# Altium schematic sheet HMI.SchDoc
size A4
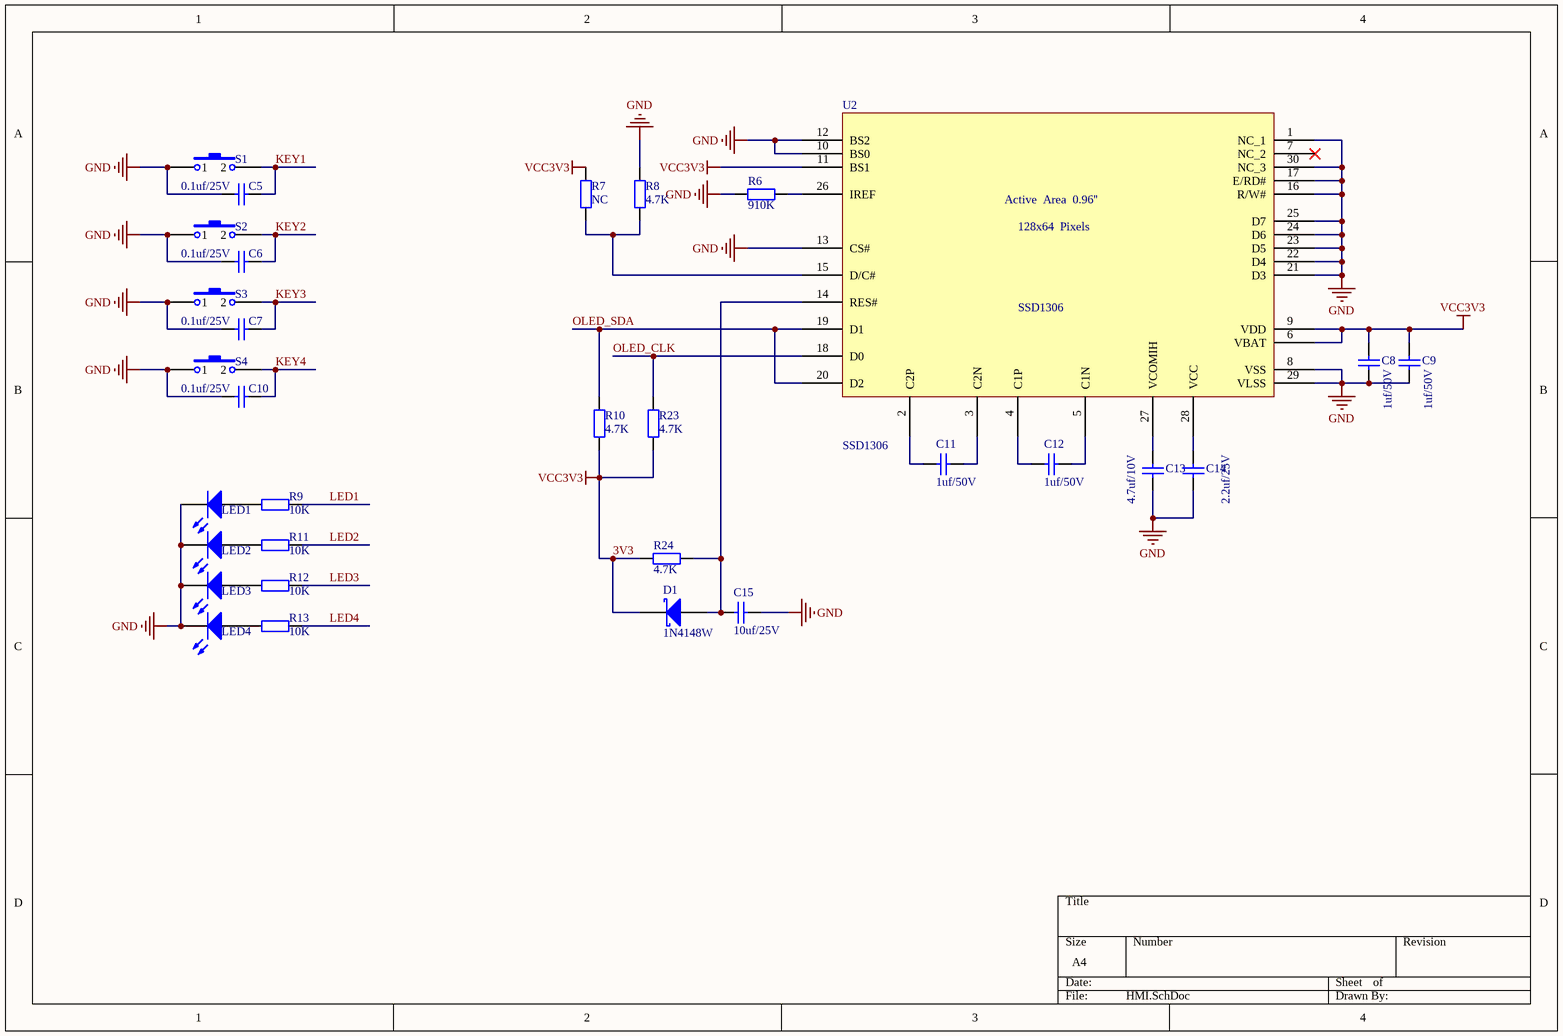
[diagram p0: HMI.SchDoc]

## Parts
C5  0.1uf/25V  [C_0603]
C6  0.1uf/25V  [C_0603]
C7  0.1uf/25V  [C_0603]
C8  1uf/50V  [C_0603]
C9  1uf/50V  [C_0603]
C10  0.1uf/25V  [C_0603]
C11  1uf/50V  [C_0603]
C12  1uf/50V  [C_0603]
C13  4.7uf/10V  [C_0603]
C14  2.2uf/25V  [C_0603]
C15  10uf/25V  [C_0603]
D1  1N4148W  [SOD123]
LED1  19-21SYGC/S530-E2/TR8  [LED_0603]  (value not drawn)
LED2  19-21SYGC/S530-E2/TR8  [LED_0603]  (value not drawn)
LED3  19-21SYGC/S530-E2/TR8  [LED_0603]  (value not drawn)
LED4  19-21SYGC/S530-E2/TR8  [LED_0603]  (value not drawn)
R6  910K  [R_0603]
R7  NC  [R_0603]
R8  4.7K  [R_0603]
R9  10K  [R_0603]
R10  4.7K  [R_0603]
R11  10K  [R_0603]
R12  10K  [R_0603]
R13  10K  [R_0603]
R23  4.7K  [R_0603]
R24  4.7K  [R_0603]
S1  K2-1107ST-A4SW-06  [SW-2P-6*3-SMT]  (value not drawn)
S2  K2-1107ST-A4SW-06  [SW-2P-6*3-SMT]  (value not drawn)
S3  K2-1107ST-A4SW-06  [SW-2P-6*3-SMT]  (value not drawn)
S4  K2-1107ST-A4SW-06  [SW-2P-6*3-SMT]  (value not drawn)
U2  SSD1306  [显示屏1.3"]

## Nets
3V3: C8.2 C9.2 D1.2(K) R7.2 R10.1 R23.1 R24.2 U2.6(VBAT) U2.9(VDD) U2.11(BS1)  [also labelled VCC3V3]
GND: C5.1 C6.1 C7.1 C8.1 C9.1 C10.1 C13.1 C14.1 C15.2 LED1.2(Cathode) LED2.2(Cathode) LED3.2(Cathode) LED4.2(Cathode) R6.1 R8.2 S1.1 S2.1 S3.1 S4.1 U2.1(NC_1) U2.8(VSS) U2.10(BS0) U2.12(BS2) U2.13(CS#) U2.16(R/W#) U2.17(E/RD#) U2.21(D3) U2.22(D4) U2.23(D5) U2.24(D6) U2.25(D7) U2.29(VLSS) U2.30(NC_3)
KEY1: C5.2 S1.2
KEY2: C6.2 S2.2
KEY3: C7.2 S3.2
KEY4: C10.2 S4.2
LED1: R9.2
LED2: R11.2
LED3: R12.2
LED4: R13.2
OLED_CLK: R23.2 U2.18(D0)
OLED_SDA: R10.2 U2.19(D1) U2.20(D2)
NetC11_1: C11.1 U2.2(C2P)
NetC11_2: C11.2 U2.3(C2N)
NetC12_1: C12.1 U2.4(C1P)
NetC12_2: C12.2 U2.5(C1N)
NetC13_2: C13.2 U2.27(VCOMIH)
NetC14_2: C14.2 U2.28(VCC)
NetC15_1: C15.1 D1.1(A) R24.1 U2.14(RES#)
NetLED1_1: LED1.1(Anode) R9.1
NetLED2_1: LED2.1(Anode) R11.1
NetLED3_1: LED3.1(Anode) R12.1
NetLED4_1: LED4.1(Anode) R13.1
NetR6_2: R6.2 U2.26(IREF)
NetR7_1: R7.1 R8.1 U2.15(D/C#)

Not connected (* = marked no-connect by the designer): U2 7(NC_2)*

## Notes on the sheet
- (in symbol SSD1306) Active  Area  0.96''; 128x64  Pixels

## Library data of the parts
C5-C7 C10 = C-0603-0.1uf/25V-10%: 多层片式陶瓷电容器; 精度: 5%; 物料厂家: YAGEO; 原厂订货号: CC0603JRX7R8BB104; 封装: C_0603; 描述: 多层片式陶瓷电容器; 值: 0.1uf/25V
C8 C9 C11 C12 = C-0603-1uf/50V-10%: 多层片式陶瓷电容器; 精度: 10%; 物料厂家: 三星; 原厂订货号: CL10A105KB8NNNC; 天远物料编号: 141111000270; 封装: C_0603; 描述: 多层片式陶瓷电容器; 值: 1uf/50V
C13 = C-0603-4.7uf/10V-10%: 多层片式陶瓷电容器; 精度: 10%; 物料厂家: SAMSUNG; 原厂订货号: CL10A475KP8NNNC; 天远物料编号: 141111000311; 封装: C_0603; 描述: 多层片式陶瓷电容器; 值: 4.7uf/10V
C14 = C-0603-2.2uf/25V-10%: 多层片式陶瓷电容器; 精度: 10%; 物料厂家: Yageo; 原厂订货号: CC0603KRX5R8BB225; 天远物料编号: 141111000026; 封装: C_0603; 描述: 多层片式陶瓷电容器; 值: 2.2uf/25V
C15 = C-0603-10uf/25V-20%: 多层片式陶瓷电容器; 精度: 20%; 物料厂家: Samsung; 原厂订货号: CL10A106MA8NRNC; 天远物料编号: 141111000275; 封装: C_0603; 描述: 多层片式陶瓷电容器; 值: 10uf/25V
D1 = D_Schottky_1N4148W: 肖特基二极管SOD123; 物料厂家: MDD; 描述: 肖特基二极管   100V,150mA,trr=4ns,VF=1.25V@150mA,PD=200mW; 天远物料编号: 141112000002; 精度: *; 封装: SOD123; 原厂订货号: 1N4148W; 值: 1N4148W
LED1-LED4 = LED1_19-21SYGC/S530-E2/TR8: 发光二极管0603黄绿色; 物料厂家: EVERLIGHT; 描述: 发光二极管   发光二极管 黄绿色 21mcd@20mA; 封装: 0603; 原厂订货号: 19-21SYGC/S530-E2/TR8; 值: 19-21SYGC/S530-E2/TR8
R6 = R-0603-698K-1%: 通用电阻; 精度: 1%; 物料厂家: Yageo; 描述: 薄膜精密电阻; 原厂订货号: AC0603FR-07698KL; 天远物料编号: 141110000029; 值: 698K; 封装: R_0603
R7 = R-0603-4.7K-1%: 通用电阻; 精度: 1%; 物料厂家: Yageo; 描述: 薄膜精密电阻; 原厂订货号: AC0603FR-074K7L; 天远物料编号: 141110000004; 值: 4.7K; 封装: R_0603
R8 R10 R23 R24 = R-0603-4.7K-1%: 通用电阻; 精度: 1%; 物料厂家: Yageo; 描述: 薄膜精密电阻; 原厂订货号: AC0603FR-074K7L; 天远物料编号: 141110000004; 封装: R_0603; 值: 4.7K
R9 R11-R13 = R-0603-10K-1%: 通用电阻; 精度: 1%; 物料厂家: Yageo; 描述: 薄膜精密电阻; 原厂订货号: AC0603FR-0710KL; 封装: R_0603; 值: 10K
S1-S4 = KEY_K2-1107ST-A4SW-06: 轻触开关3.6*6.1*2.5; 描述: 轻触开关 3.6*6.1*2.5 灰头; 物料厂家: 韩国韩荣; 原厂订货号: K2-1107ST-A4SW-06; 封装: 3.6*6.1*2.5; 值: K2-1107ST-A4SW-06
U2 = SSD1306: OLED显示模块主控芯片; 原厂订货号: UG-2864KSWLG01; 封装: 1.3''; 物料厂家: UG; 值: SSD1306; 天远物料编号: *; 描述: OLED显示模块主控芯片; 精度: *